# Altium schematic sheet [0X] - CPU SIGNAL.SchDoc
size 817 x 513 mm
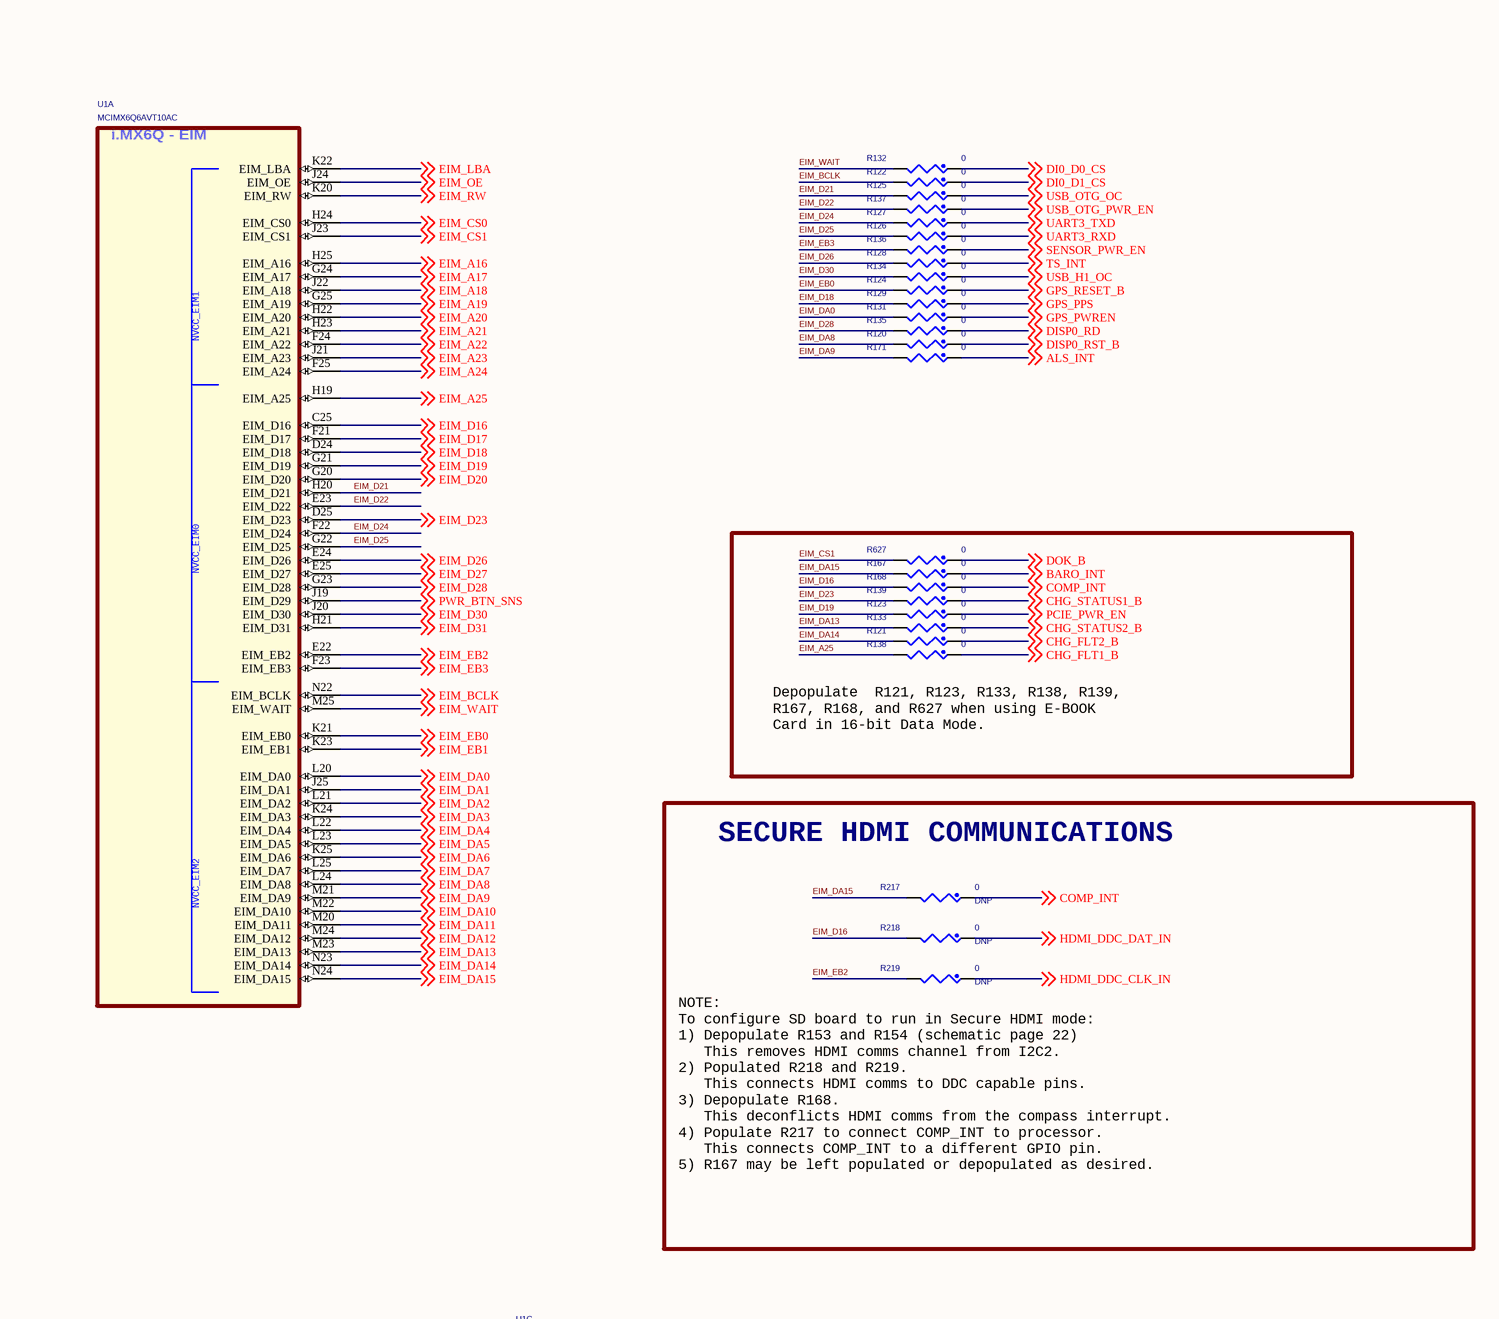
[diagram p0: [0X] - CPU SIGNAL.SchDoc, top left]
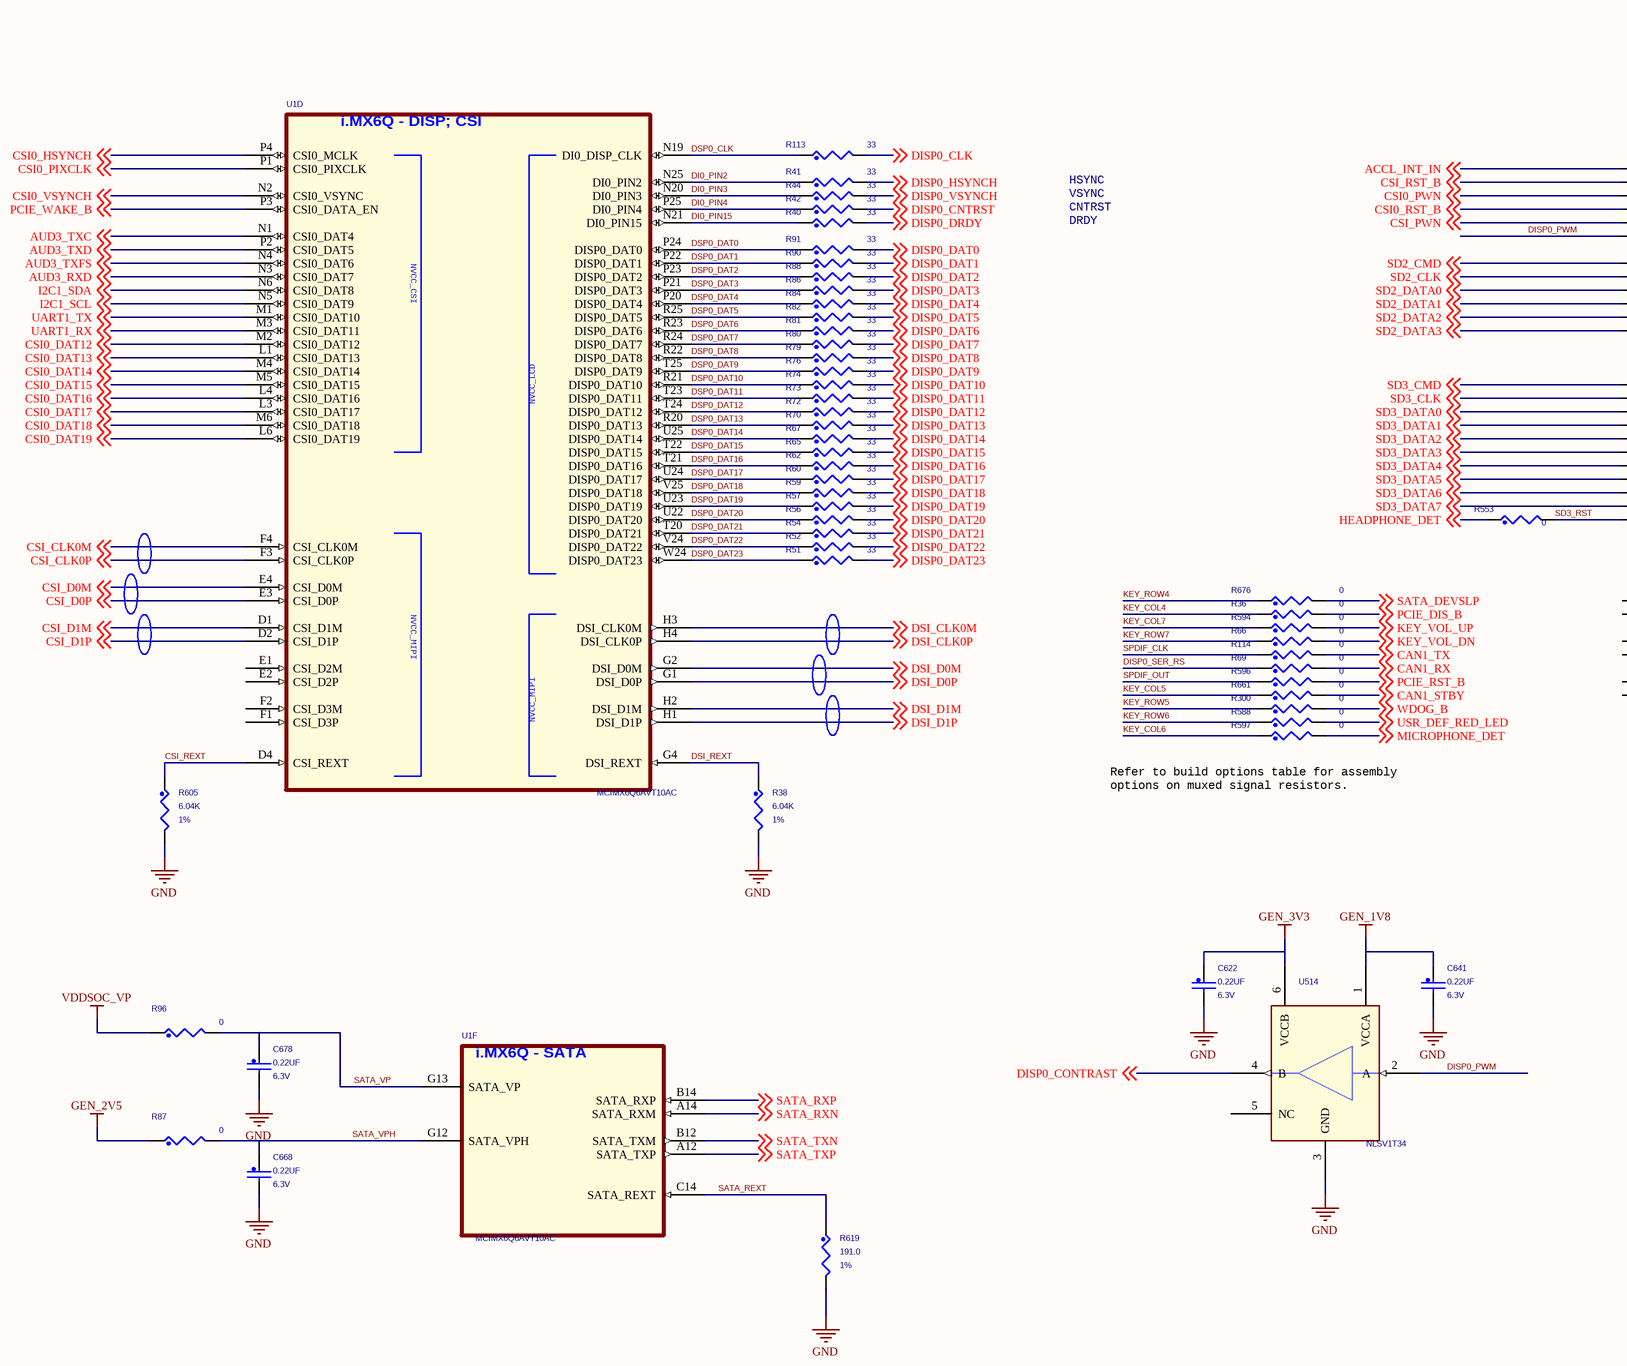
[diagram p1: [0X] - CPU SIGNAL.SchDoc, top middle]
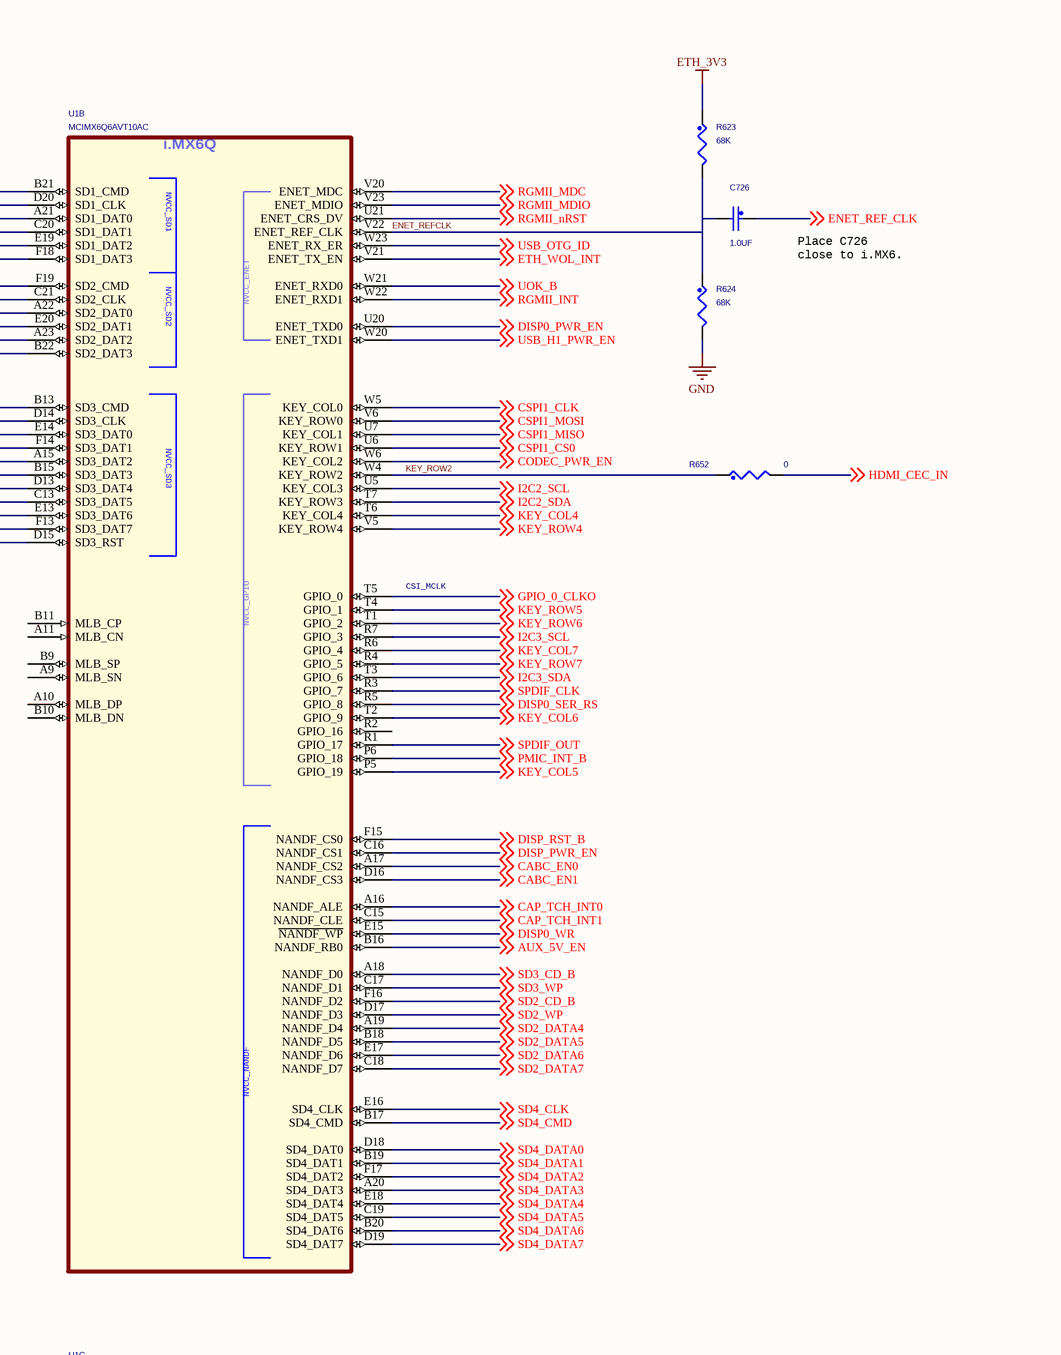
[diagram p2: [0X] - CPU SIGNAL.SchDoc, top right]
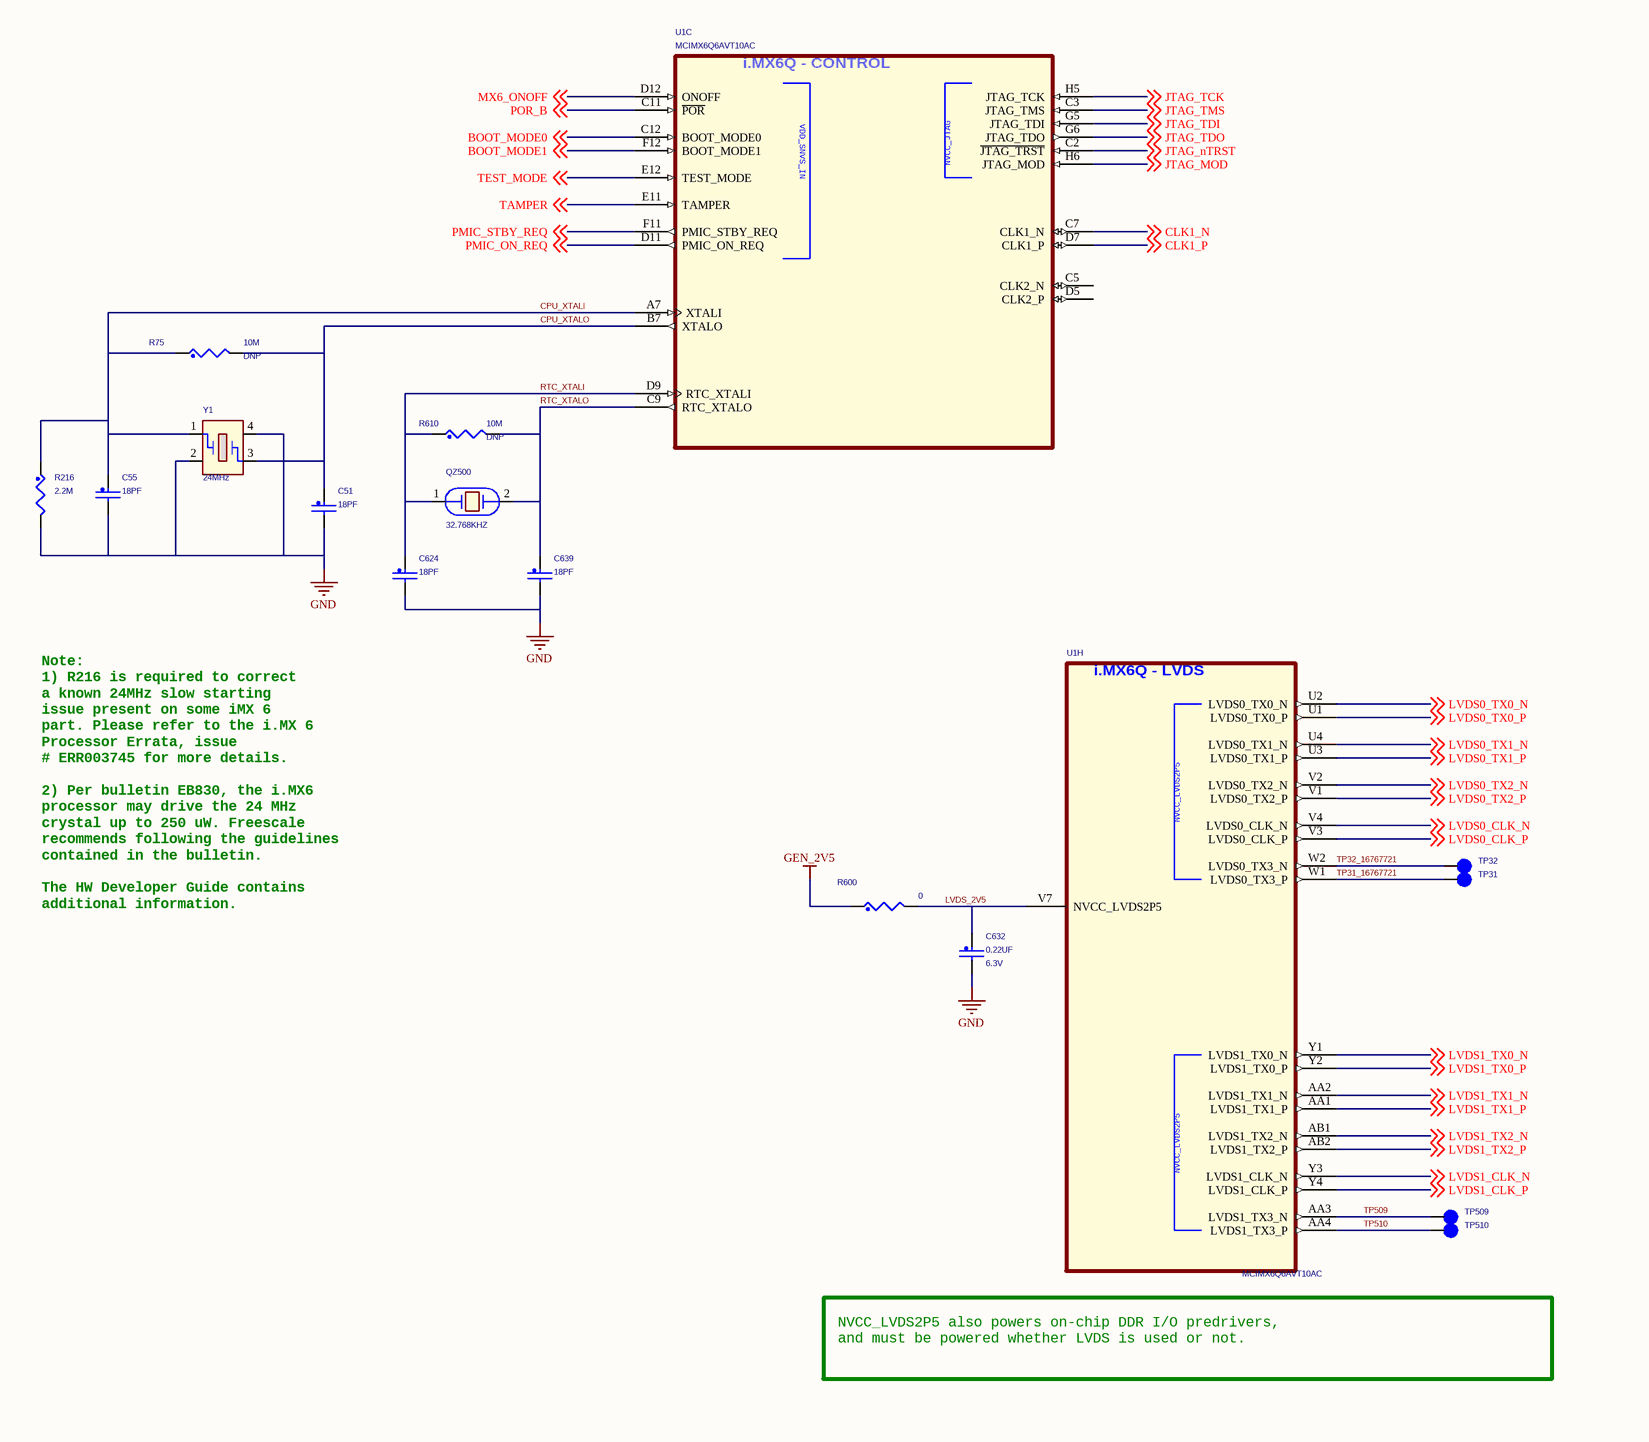
[diagram p3: [0X] - CPU SIGNAL.SchDoc, bottom left]
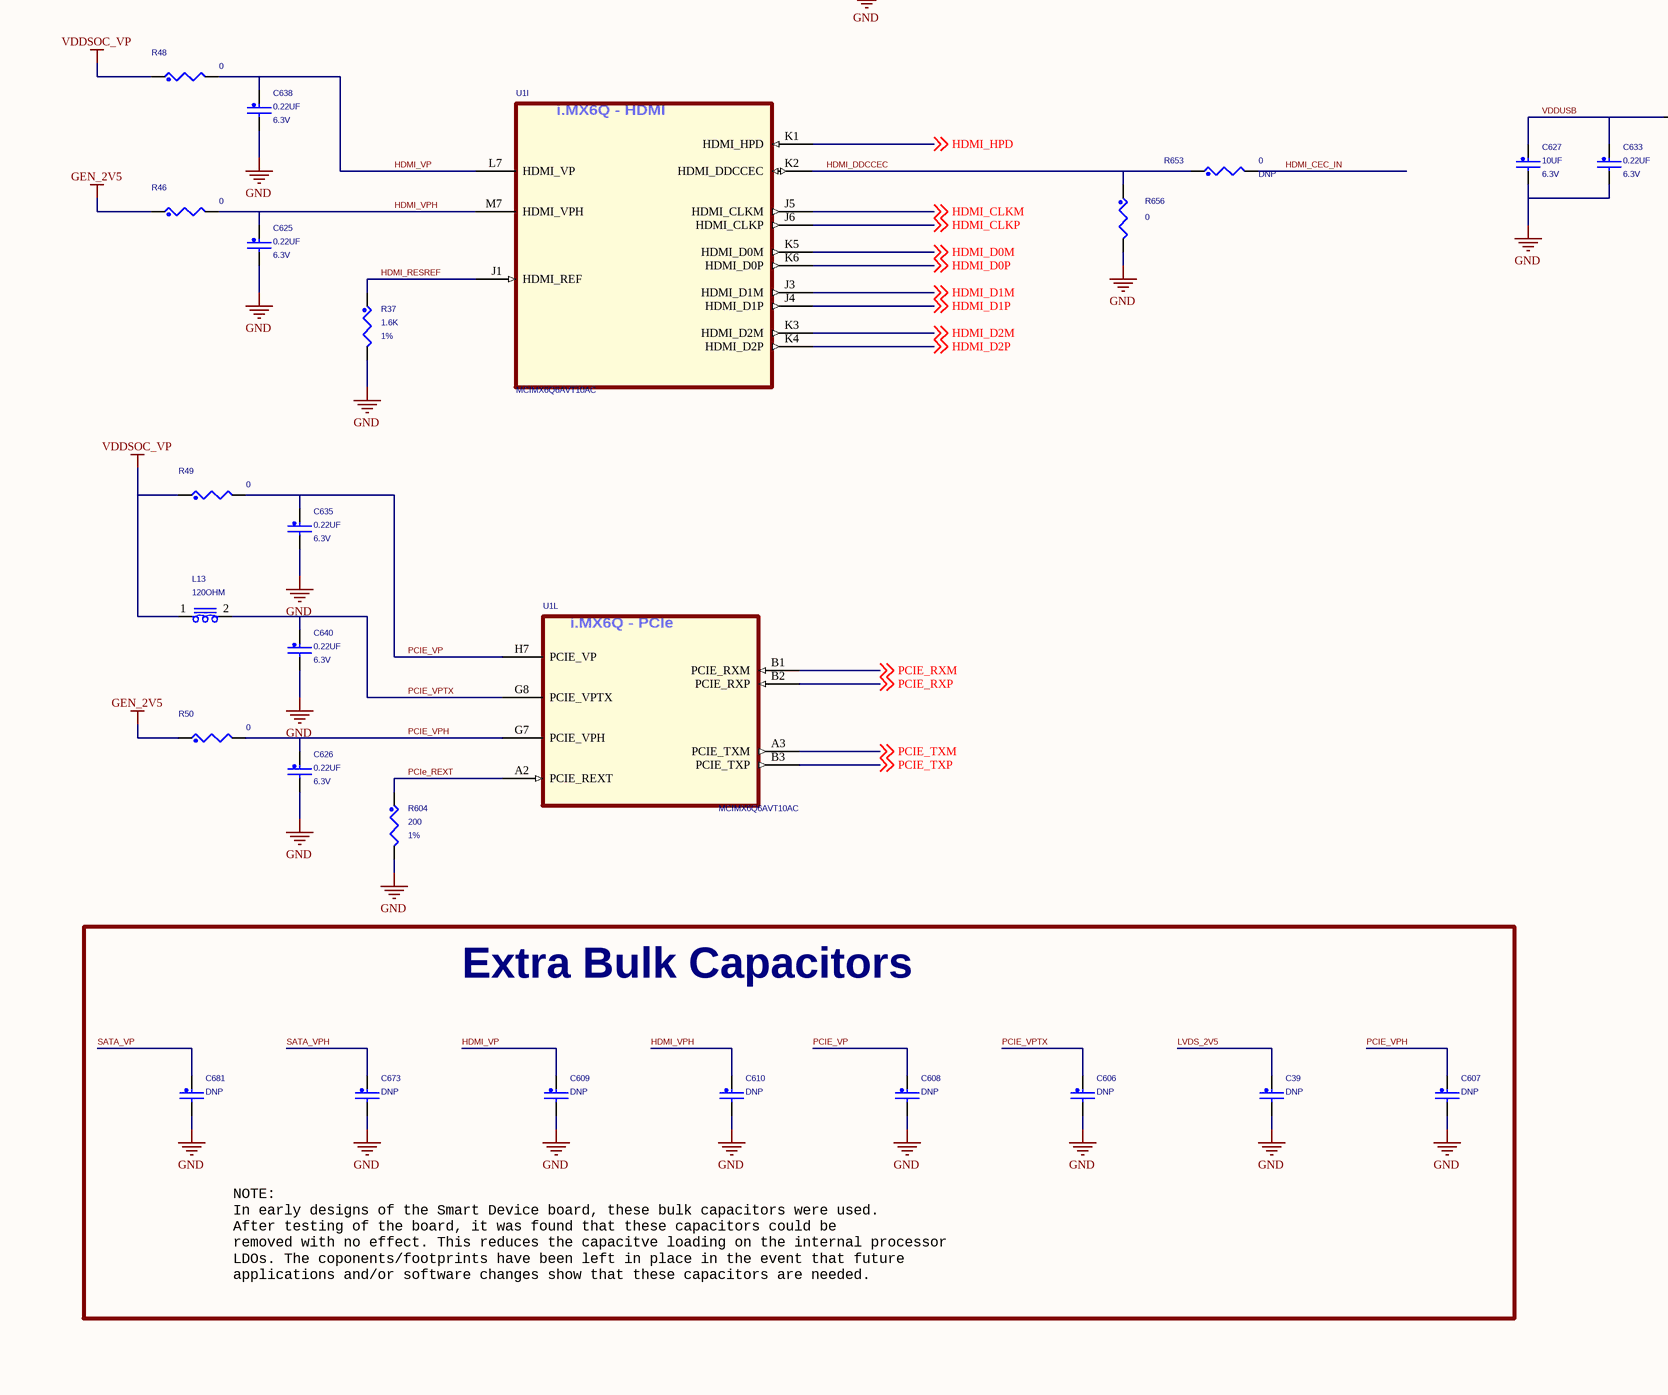
[diagram p4: [0X] - CPU SIGNAL.SchDoc, bottom middle]
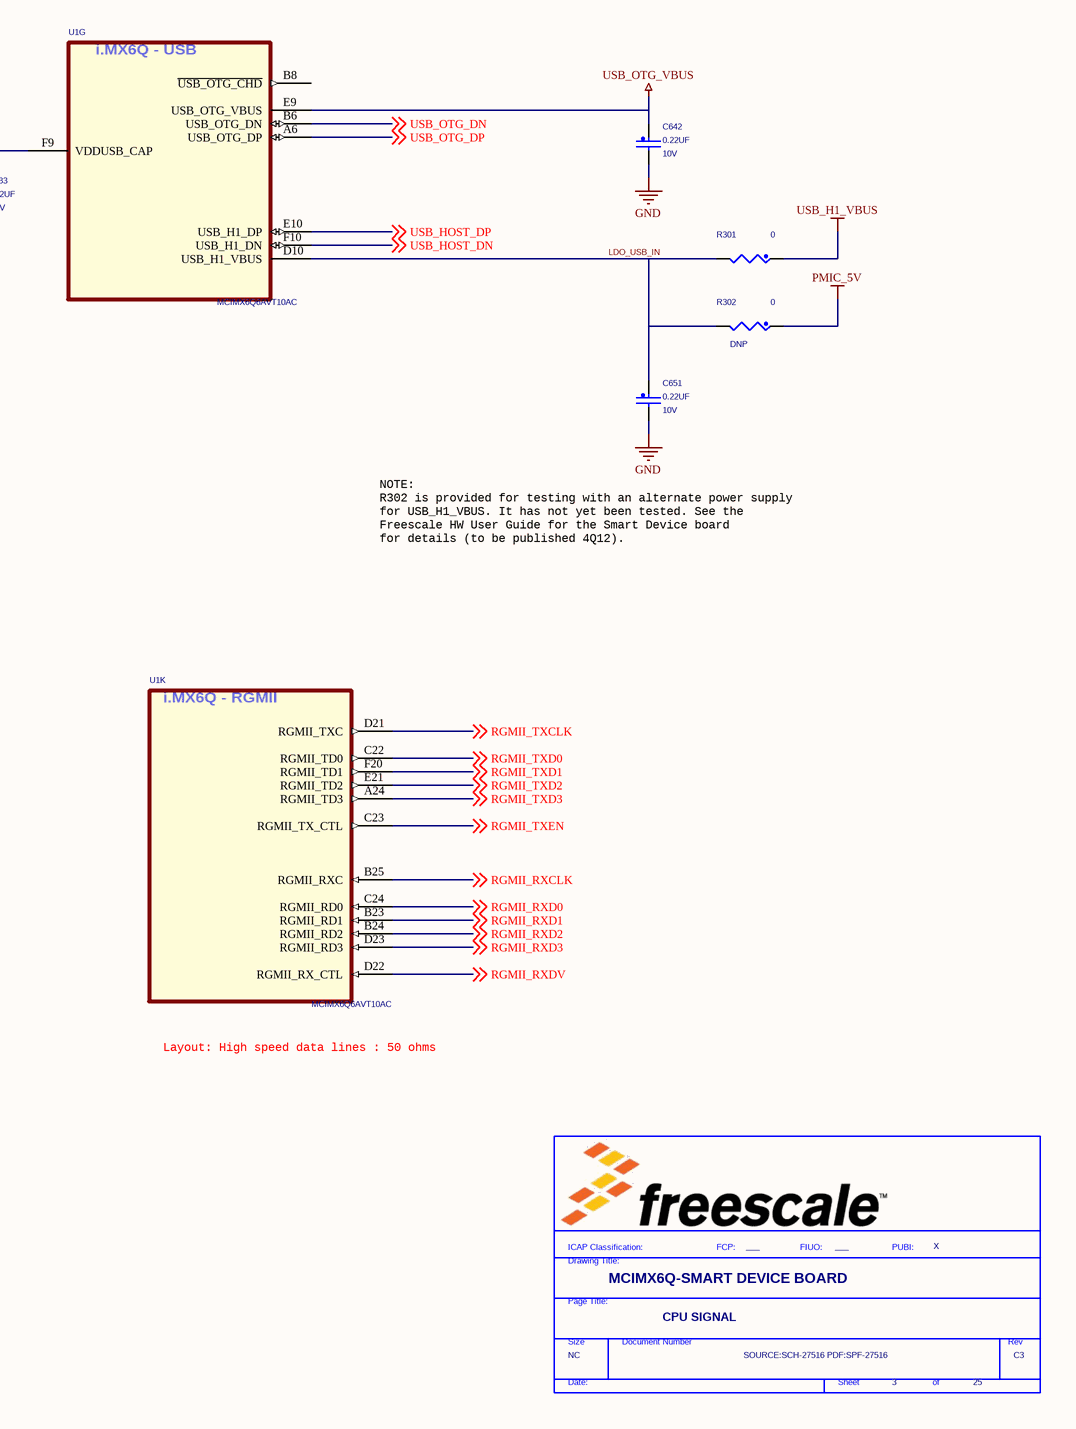
[diagram p5: [0X] - CPU SIGNAL.SchDoc, bottom right]

## Parts
*  FIUO: ___  PUBI: X  Doc: SOURCE:SCH-27516 PDF:SPF-27516  RevCode: C3  Title: MCIMX6Q-SMART DEVICE BOARD  Page Size: NC  Page Number: 3  Page Count: 25  PageTitle: CPU SIGNAL  (hidden comment: TitleBlock_FS)  (graphical)
C39  ASSY_OPT: DNP  [0603_CC]  (hidden comment: 4.7UF)
C51  18PF  [0402_CC]
C55  18PF  [0402_CC]
C606  ASSY_OPT: DNP  [0603_CC]  (hidden comment: 4.7UF)
C607  ASSY_OPT: DNP  [0603_CC]  (hidden comment: 4.7UF)
C608  ASSY_OPT: DNP  [0603_CC]  (hidden comment: 4.7UF)
C609  ASSY_OPT: DNP  [0603_CC]  (hidden comment: 4.7UF)
C610  ASSY_OPT: DNP  [0603_CC]  (hidden comment: 4.7UF)
C622  0.22UF  WVDC: 6.3V  [0201_CC]
C624  18PF  [0402_CC]
C625  0.22UF  WVDC: 6.3V  [0201_CC]
C626  0.22UF  WVDC: 6.3V  [0201_CC]
C627  10UF  WVDC: 6.3V  [0603_CC]
C632  0.22UF  WVDC: 6.3V  [0201_CC]
C633  0.22UF  WVDC: 6.3V  [0201_CC]
C635  0.22UF  WVDC: 6.3V  [0201_CC]
C638  0.22UF  WVDC: 6.3V  [0201_CC]
C639  18PF  [0402_CC]
C640  0.22UF  WVDC: 6.3V  [0201_CC]
C641  0.22UF  WVDC: 6.3V  [0201_CC]
C642  0.22UF  WVDC: 10V  [0201_CC]
C651  0.22UF  WVDC: 10V  [0201_CC]
C668  0.22UF  WVDC: 6.3V  [0201_CC]
C673  ASSY_OPT: DNP  [0603_CC]  (hidden comment: 4.7UF)
C678  0.22UF  WVDC: 6.3V  [0201_CC]
C681  ASSY_OPT: DNP  [0603_CC]  (hidden comment: 4.7UF)
C726  1.0UF  [0402_CC]
L13  120OHM  [0603_CC]
QZ500  32.768KHZ  [XTAL2-3P2X1P5-SM]
R36  0  [0402_CC]
R37  1.6K  Tolerance: 1%  [0402_CC]
R38  6.04K  Tolerance: 1%  [0402_CC]
R40  33  [0402_CC]
R41  33  [0402_CC]
R42  33  [0402_CC]
R44  33  [0402_CC]
R46  0  [0402_CC]
R48  0  [0402_CC]
R49  0  [0402_CC]
R50  0  [0402_CC]
R51  33  [0402_CC]
R52  33  [0402_CC]
R54  33  [0402_CC]
R56  33  [0402_CC]
R57  33  [0402_CC]
R59  33  [0402_CC]
R60  33  [0402_CC]
R62  33  [0402_CC]
R65  33  [0402_CC]
R66  0  [0402_CC]
R67  33  [0402_CC]
R69  0  [0402_CC]
R70  33  [0402_CC]
R72  33  [0402_CC]
R73  33  [0402_CC]
R74  33  [0402_CC]
R75  10M  ASSY_OPT: DNP  [0402_CC]
R76  33  [0402_CC]
R79  33  [0402_CC]
R80  33  [0402_CC]
R81  33  [0402_CC]
R82  33  [0402_CC]
R84  33  [0402_CC]
R86  33  [0402_CC]
R87  0  [0402_CC]
R88  33  [0402_CC]
R90  33  [0402_CC]
R91  33  [0402_CC]
R96  0  [0402_CC]
R113  33  [0402_CC]
R114  0  [0402_CC]
R120  0  [0402_CC]
R121  0  [0402_CC]
R122  0  [0402_CC]
R123  0  [0402_CC]
R124  0  [0402_CC]
R125  0  [0402_CC]
R126  0  [0402_CC]
R127  0  [0402_CC]
R128  0  [0402_CC]
R129  0  [0402_CC]
R131  0  [0402_CC]
R132  0  [0402_CC]
R133  0  [0402_CC]
R134  0  [0402_CC]
R135  0  [0402_CC]
R136  0  [0402_CC]
R137  0  [0402_CC]
R138  0  [0402_CC]
R139  0  [0402_CC]
R167  0  [0402_CC]
R168  0  [0402_CC]
R171  0  [0402_CC]
R216  2.2M  [0402_CC]
R217  0  ASSY_OPT: DNP  [0402_CC]
R218  0  ASSY_OPT: DNP  [0402_CC]
R219  0  ASSY_OPT: DNP  [0402_CC]
R300  0  [0402_CC]
R301  0  [0402_CC]
R302  0  ASSY_OPT: DNP  [0402_CC]
R553  0  [0402_CC]
R588  0  [0402_CC]
R594  0  [0402_CC]
R596  0  [0402_CC]
R597  0  [0402_CC]
R600  0  [0402_CC]
R604  200  Tolerance: 1%  [0402_CC]
R605  6.04K  Tolerance: 1%  [0402_CC]
R610  10M  ASSY_OPT: DNP  [0402_CC]
R619  191.0  Tolerance: 1%  [0603_CC]
R623  68K  [0402_CC]
R624  68K  [0402_CC]
R627  0  [0402_CC]
R652  0  [0402_CC]
R653  0  ASSY_OPT: DNP  [0402_CC]
R656  0  [0402_CC]
R661  0  [0402_CC]
R676  0  [0402_CC]
TP31  tpad_020  [tpad_020]  (value not drawn)
TP32  tpad_020  [tpad_020]  (value not drawn)
TP509  tpad_020  [tpad_020]  (value not drawn)
TP510  tpad_020  [tpad_020]  (value not drawn)
U1  MCIMX6Q6AVT10AC  [BGA624_0P8_21X21]  (parts A,B,C,D,F,G,H,I,K,L of 12)
U514  NLSV1T34  [ullga6_1p45x1_0p5mm]
Y1  24MHz  [xtal4_sx_3225]

## Blocks framed on the sheet
SECURE HDMI COMMUNICATIONS: R217-R219
Extra Bulk Capacitors: C39 C606-C610 C673 C681

## Nets
ETH_3V3: R623.1
GEN_1V8: C641.1 U514.1(VCCA)
GEN_2V5: R46.1 R50.1 R87.1 R600.1
GEN_3V3: C622.1 U514.6(VCCB)
GND: C39.2 C51.2 C55.2 C606.2 C607.2 C608.2 C609.2 C610.2 C622.2 C624.2 C625.2 C626.2 C627.2 C632.2 C633.2 C635.2 C638.2 C639.2 C640.2 C641.2 C642.2 C651.2 C668.2 C673.2 C678.2 C681.2 R37.2 R38.2 R216.2 R604.2 R605.2 R619.2 R624.2 R656.2 U514.3(GND) Y1.2 Y1.4
PMIC_5V: R302.1
USB_H1_VBUS: R301.1
USB_OTG_VBUS: C642.1 U1.E9(USB_OTG_VBUS)
VDDSOC_VP: L13.1 R48.1 R49.1 R96.1
ACCL_INT_IN: U1.B21(SD1_CMD) ; off-sheet ACCL_INT_IN
ALS_INT: R171.1 ; off-sheet ALS_INT
AUD3_RXD: U1.N3(CSI0_DAT7) ; off-sheet AUD3_RXD
AUD3_TXC: U1.N1(CSI0_DAT4) ; off-sheet AUD3_TXC
AUD3_TXD: U1.P2(CSI0_DAT5) ; off-sheet AUD3_TXD
AUD3_TXFS: U1.N4(CSI0_DAT6) ; off-sheet AUD3_TXFS
AUX_5V_EN: U1.B16(NANDF_RB0) ; off-sheet AUX_5V_EN
BARO_INT: R167.1 ; off-sheet BARO_INT
BOOT_MODE0: U1.C12(BOOT_MODE0) ; off-sheet BOOT_MODE0
BOOT_MODE1: U1.F12(BOOT_MODE1) ; off-sheet BOOT_MODE1
CABC_EN0: U1.A17(NANDF_CS2) ; off-sheet CABC_EN0
CABC_EN1: U1.D16(NANDF_CS3) ; off-sheet CABC_EN1
CAN1_RX: R69.2 ; off-sheet CAN1_RX
CAN1_STBY: R661.2 ; off-sheet CAN1_STBY
CAN1_TX: R114.2 ; off-sheet CAN1_TX
CAP_TCH_INT0: U1.A16(NANDF_ALE) ; off-sheet CAP_TCH_INT0
CAP_TCH_INT1: U1.C15(NANDF_CLE) ; off-sheet CAP_TCH_INT1
CHG_FLT1_B: R138.1 ; off-sheet CHG_FLT1_B
CHG_FLT2_B: R121.1 ; off-sheet CHG_FLT2_B
CHG_STATUS1_B: R139.1 ; off-sheet CHG_STATUS1_B
CHG_STATUS2_B: R133.1 ; off-sheet CHG_STATUS2_B
CLK1_N: U1.C7(CLK1_N) ; off-sheet CLK1_N
CLK1_P: U1.D7(CLK1_P) ; off-sheet CLK1_P
CODEC_PWR_EN: U1.W6(KEY_COL2) ; off-sheet CODEC_PWR_EN
COMP_INT: R168.1 R217.1 ; off-sheet COMP_INT
CPU_XTALI: C55.1 R75.1 R216.1 U1.A7(XTALI) Y1.1
CPU_XTALO: C51.1 R75.2 U1.B7(XTALO) Y1.3
CSI0_DAT12: U1.M2(CSI0_DAT12) ; off-sheet CSI0_DAT12
CSI0_DAT13: U1.L1(CSI0_DAT13) ; off-sheet CSI0_DAT13
CSI0_DAT14: U1.M4(CSI0_DAT14) ; off-sheet CSI0_DAT14
CSI0_DAT15: U1.M5(CSI0_DAT15) ; off-sheet CSI0_DAT15
CSI0_DAT16: U1.L4(CSI0_DAT16) ; off-sheet CSI0_DAT16
CSI0_DAT17: U1.L3(CSI0_DAT17) ; off-sheet CSI0_DAT17
CSI0_DAT18: U1.M6(CSI0_DAT18) ; off-sheet CSI0_DAT18
CSI0_DAT19: U1.L6(CSI0_DAT19) ; off-sheet CSI0_DAT19
CSI0_HSYNCH: U1.P4(CSI0_MCLK) ; off-sheet CSI0_HSYNCH
CSI0_PIXCLK: U1.P1(CSI0_PIXCLK) ; off-sheet CSI0_PIXCLK
CSI0_PWN: U1.A21(SD1_DAT0) ; off-sheet CSI0_PWN
CSI0_RST_B: U1.C20(SD1_DAT1) ; off-sheet CSI0_RST_B
CSI0_VSYNCH: U1.N2(CSI0_VSYNC) ; off-sheet CSI0_VSYNCH
CSI_CLK0M: U1.F4(CSI_CLK0M) ; off-sheet CSI_CLK0M
CSI_CLK0P: U1.F3(CSI_CLK0P) ; off-sheet CSI_CLK0P
CSI_D0M: U1.E4(CSI_D0M) ; off-sheet CSI_D0M
CSI_D0P: U1.E3(CSI_D0P) ; off-sheet CSI_D0P
CSI_D1M: U1.D1(CSI_D1M) ; off-sheet CSI_D1M
CSI_D1P: U1.D2(CSI_D1P) ; off-sheet CSI_D1P
CSI_PWN: U1.E19(SD1_DAT2) ; off-sheet CSI_PWN
CSI_REXT: R605.1 U1.D4(CSI_REXT)
CSI_RST_B: U1.D20(SD1_CLK) ; off-sheet CSI_RST_B
CSPI1_CLK: U1.W5(KEY_COL0) ; off-sheet CSPI1_CLK
CSPI1_CS0: U1.U6(KEY_ROW1) ; off-sheet CSPI1_CS0
CSPI1_MISO: U1.U7(KEY_COL1) ; off-sheet CSPI1_MISO
CSPI1_MOSI: U1.V6(KEY_ROW0) ; off-sheet CSPI1_MOSI
DI0_D0_CS: R132.1 ; off-sheet DI0_D0_CS
DI0_D1_CS: R122.1 ; off-sheet DI0_D1_CS
DI0_PIN2: R41.1 U1.N25(DI0_PIN2)
DI0_PIN3: R44.1 U1.N20(DI0_PIN3)
DI0_PIN4: R42.1 U1.P25(DI0_PIN4)
DI0_PIN15: R40.1 U1.N21(DI0_PIN15)
DISP0_CLK: R113.2 ; off-sheet DISP0_CLK
DISP0_CNTRST: R42.2 ; off-sheet DISP0_CNTRST
DISP0_CONTRAST: U514.4(B) ; off-sheet DISP0_CONTRAST
DISP0_DAT0: R91.2 ; off-sheet DISP0_DAT0
DISP0_DAT1: R90.2 ; off-sheet DISP0_DAT1
DISP0_DAT2: R88.2 ; off-sheet DISP0_DAT2
DISP0_DAT3: R86.2 ; off-sheet DISP0_DAT3
DISP0_DAT4: R84.2 ; off-sheet DISP0_DAT4
DISP0_DAT5: R82.2 ; off-sheet DISP0_DAT5
DISP0_DAT6: R81.2 ; off-sheet DISP0_DAT6
DISP0_DAT7: R80.2 ; off-sheet DISP0_DAT7
DISP0_DAT8: R79.2 ; off-sheet DISP0_DAT8
DISP0_DAT9: R76.2 ; off-sheet DISP0_DAT9
DISP0_DAT10: R74.2 ; off-sheet DISP0_DAT10
DISP0_DAT11: R73.2 ; off-sheet DISP0_DAT11
DISP0_DAT12: R72.2 ; off-sheet DISP0_DAT12
DISP0_DAT13: R70.2 ; off-sheet DISP0_DAT13
DISP0_DAT14: R67.2 ; off-sheet DISP0_DAT14
DISP0_DAT15: R65.2 ; off-sheet DISP0_DAT15
DISP0_DAT16: R62.2 ; off-sheet DISP0_DAT16
DISP0_DAT17: R60.2 ; off-sheet DISP0_DAT17
DISP0_DAT18: R59.2 ; off-sheet DISP0_DAT18
DISP0_DAT19: R57.2 ; off-sheet DISP0_DAT19
DISP0_DAT20: R56.2 ; off-sheet DISP0_DAT20
DISP0_DAT21: R54.2 ; off-sheet DISP0_DAT21
DISP0_DAT22: R52.2 ; off-sheet DISP0_DAT22
DISP0_DAT23: R51.2 ; off-sheet DISP0_DAT23
DISP0_DRDY: R40.2 ; off-sheet DISP0_DRDY
DISP0_HSYNCH: R41.2 ; off-sheet DISP0_HSYNCH
DISP0_PWM: U1.F18(SD1_DAT3) U514.2(A)
DISP0_PWR_EN: U1.U20(ENET_TXD0) ; off-sheet DISP0_PWR_EN
DISP0_RD: R135.1 ; off-sheet DISP0_RD
DISP0_RST_B: R120.1 ; off-sheet DISP0_RST_B
DISP0_SER_RS: R69.1 U1.R5(GPIO_8) ; off-sheet DISP0_SER_RS
DISP0_VSYNCH: R44.2 ; off-sheet DISP0_VSYNCH
DISP0_WR: U1.E15(~{NANDF_WP}) ; off-sheet DISP0_WR
DISP_PWR_EN: U1.C16(NANDF_CS1) ; off-sheet DISP_PWR_EN
DISP_RST_B: U1.F15(NANDF_CS0) ; off-sheet DISP_RST_B
DOK_B: R627.1 ; off-sheet DOK_B
DSI_CLK0M: U1.H3(DSI_CLK0M) ; off-sheet DSI_CLK0M
DSI_CLK0P: U1.H4(DSI_CLK0P) ; off-sheet DSI_CLK0P
DSI_D0M: U1.G2(DSI_D0M) ; off-sheet DSI_D0M
DSI_D0P: U1.G1(DSI_D0P) ; off-sheet DSI_D0P
DSI_D1M: U1.H2(DSI_D1M) ; off-sheet DSI_D1M
DSI_D1P: U1.H1(DSI_D1P) ; off-sheet DSI_D1P
DSI_REXT: R38.1 U1.G4(DSI_REXT)
DSP0_CLK: R113.1 U1.N19(DI0_DISP_CLK)
DSP0_DAT0: R91.1 U1.P24(DISP0_DAT0)
DSP0_DAT1: R90.1 U1.P22(DISP0_DAT1)
DSP0_DAT2: R88.1 U1.P23(DISP0_DAT2)
DSP0_DAT3: R86.1 U1.P21(DISP0_DAT3)
DSP0_DAT4: R84.1 U1.P20(DISP0_DAT4)
DSP0_DAT5: R82.1 U1.R25(DISP0_DAT5)
DSP0_DAT6: R81.1 U1.R23(DISP0_DAT6)
DSP0_DAT7: R80.1 U1.R24(DISP0_DAT7)
DSP0_DAT8: R79.1 U1.R22(DISP0_DAT8)
DSP0_DAT9: R76.1 U1.T25(DISP0_DAT9)
DSP0_DAT10: R74.1 U1.R21(DISP0_DAT10)
DSP0_DAT11: R73.1 U1.T23(DISP0_DAT11)
DSP0_DAT12: R72.1 U1.T24(DISP0_DAT12)
DSP0_DAT13: R70.1 U1.R20(DISP0_DAT13)
DSP0_DAT14: R67.1 U1.U25(DISP0_DAT14)
DSP0_DAT15: R65.1 U1.T22(DISP0_DAT15)
DSP0_DAT16: R62.1 U1.T21(DISP0_DAT16)
DSP0_DAT17: R60.1 U1.U24(DISP0_DAT17)
DSP0_DAT18: R59.1 U1.V25(DISP0_DAT18)
DSP0_DAT19: R57.1 U1.U23(DISP0_DAT19)
DSP0_DAT20: R56.1 U1.U22(DISP0_DAT20)
DSP0_DAT21: R54.1 U1.T20(DISP0_DAT21)
DSP0_DAT22: R52.1 U1.V24(DISP0_DAT22)
DSP0_DAT23: R51.1 U1.W24(DISP0_DAT23)
EIM_A16: U1.H25(EIM_A16) ; off-sheet EIM_A16
EIM_A17: U1.G24(EIM_A17) ; off-sheet EIM_A17
EIM_A18: U1.J22(EIM_A18) ; off-sheet EIM_A18
EIM_A19: U1.G25(EIM_A19) ; off-sheet EIM_A19
EIM_A20: U1.H22(EIM_A20) ; off-sheet EIM_A20
EIM_A21: U1.H23(EIM_A21) ; off-sheet EIM_A21
EIM_A22: U1.F24(EIM_A22) ; off-sheet EIM_A22
EIM_A23: U1.J21(EIM_A23) ; off-sheet EIM_A23
EIM_A24: U1.F25(EIM_A24) ; off-sheet EIM_A24
EIM_A25: R138.2 U1.H19(EIM_A25) ; off-sheet EIM_A25
EIM_BCLK: R122.2 U1.N22(EIM_BCLK) ; off-sheet EIM_BCLK
EIM_CS0: U1.H24(EIM_CS0) ; off-sheet EIM_CS0
EIM_CS1: R627.2 U1.J23(EIM_CS1) ; off-sheet EIM_CS1
EIM_D16: R168.2 R218.2 U1.C25(EIM_D16) ; off-sheet EIM_D16
EIM_D17: U1.F21(EIM_D17) ; off-sheet EIM_D17
EIM_D18: R129.2 U1.D24(EIM_D18) ; off-sheet EIM_D18
EIM_D19: R123.2 U1.G21(EIM_D19) ; off-sheet EIM_D19
EIM_D20: U1.G20(EIM_D20) ; off-sheet EIM_D20
EIM_D21: R125.2 U1.H20(EIM_D21)
EIM_D22: R137.2 U1.E23(EIM_D22)
EIM_D23: R139.2 U1.D25(EIM_D23) ; off-sheet EIM_D23
EIM_D24: R127.2 U1.F22(EIM_D24)
EIM_D25: R126.2 U1.G22(EIM_D25)
EIM_D26: R128.2 U1.E24(EIM_D26) ; off-sheet EIM_D26
EIM_D27: U1.E25(EIM_D27) ; off-sheet EIM_D27
EIM_D28: R135.2 U1.G23(EIM_D28) ; off-sheet EIM_D28
EIM_D30: R134.2 U1.J20(EIM_D30) ; off-sheet EIM_D30
EIM_D31: U1.H21(EIM_D31) ; off-sheet EIM_D31
EIM_DA0: R131.2 U1.L20(EIM_DA0) ; off-sheet EIM_DA0
EIM_DA1: U1.J25(EIM_DA1) ; off-sheet EIM_DA1
EIM_DA2: U1.L21(EIM_DA2) ; off-sheet EIM_DA2
EIM_DA3: U1.K24(EIM_DA3) ; off-sheet EIM_DA3
EIM_DA4: U1.L22(EIM_DA4) ; off-sheet EIM_DA4
EIM_DA5: U1.L23(EIM_DA5) ; off-sheet EIM_DA5
EIM_DA6: U1.K25(EIM_DA6) ; off-sheet EIM_DA6
EIM_DA7: U1.L25(EIM_DA7) ; off-sheet EIM_DA7
EIM_DA8: R120.2 U1.L24(EIM_DA8) ; off-sheet EIM_DA8
EIM_DA9: R171.2 U1.M21(EIM_DA9) ; off-sheet EIM_DA9
EIM_DA10: U1.M22(EIM_DA10) ; off-sheet EIM_DA10
EIM_DA11: U1.M20(EIM_DA11) ; off-sheet EIM_DA11
EIM_DA12: U1.M24(EIM_DA12) ; off-sheet EIM_DA12
EIM_DA13: R133.2 U1.M23(EIM_DA13) ; off-sheet EIM_DA13
EIM_DA14: R121.2 U1.N23(EIM_DA14) ; off-sheet EIM_DA14
EIM_DA15: R167.2 R217.2 U1.N24(EIM_DA15) ; off-sheet EIM_DA15
EIM_EB0: R124.2 U1.K21(EIM_EB0) ; off-sheet EIM_EB0
EIM_EB1: U1.K23(EIM_EB1) ; off-sheet EIM_EB1
EIM_EB2: R219.2 U1.E22(EIM_EB2) ; off-sheet EIM_EB2
EIM_EB3: R136.2 U1.F23(EIM_EB3) ; off-sheet EIM_EB3
EIM_LBA: U1.K22(EIM_LBA) ; off-sheet EIM_LBA
EIM_OE: U1.J24(EIM_OE) ; off-sheet EIM_OE
EIM_RW: U1.K20(EIM_RW) ; off-sheet EIM_RW
EIM_WAIT: R132.2 U1.M25(EIM_WAIT) ; off-sheet EIM_WAIT
ENET_REF_CLK: C726.1 ; off-sheet ENET_REF_CLK
ENET_REFCLK: C726.2 R623.2 R624.1 U1.V22(ENET_REF_CLK)
ETH_WOL_INT: U1.V21(ENET_TX_EN) ; off-sheet ETH_WOL_INT
GPIO_0_CLKO: U1.T5(GPIO_0) ; off-sheet GPIO_0_CLKO
GPS_PPS: R129.1 ; off-sheet GPS_PPS
GPS_PWREN: R131.1 ; off-sheet GPS_PWREN
GPS_RESET_B: R124.1 ; off-sheet GPS_RESET_B
HDMI_CEC_IN: R652.2 R653.2 ; off-sheet HDMI_CEC_IN
HDMI_CLKM: U1.J5(HDMI_CLKM) ; off-sheet HDMI_CLKM
HDMI_CLKP: U1.J6(HDMI_CLKP) ; off-sheet HDMI_CLKP
HDMI_D0M: U1.K5(HDMI_D0M) ; off-sheet HDMI_D0M
HDMI_D0P: U1.K6(HDMI_D0P) ; off-sheet HDMI_D0P
HDMI_D1M: U1.J3(HDMI_D1M) ; off-sheet HDMI_D1M
HDMI_D1P: U1.J4(HDMI_D1P) ; off-sheet HDMI_D1P
HDMI_D2M: U1.K3(HDMI_D2M) ; off-sheet HDMI_D2M
HDMI_D2P: U1.K4(HDMI_D2P) ; off-sheet HDMI_D2P
HDMI_DDC_CLK_IN: R219.1 ; off-sheet HDMI_DDC_CLK_IN
HDMI_DDC_DAT_IN: R218.1 ; off-sheet HDMI_DDC_DAT_IN
HDMI_DDCCEC: R653.1 R656.1 U1.K2(HDMI_DDCCEC)
HDMI_HPD: U1.K1(HDMI_HPD) ; off-sheet HDMI_HPD
HDMI_RESREF: R37.1 U1.J1(HDMI_REF)
HDMI_VP: C609.1 C638.1 R48.2 U1.L7(HDMI_VP)
HDMI_VPH: C610.1 C625.1 R46.2 U1.M7(HDMI_VPH)
HEADPHONE_DET: R553.1 ; off-sheet HEADPHONE_DET
I2C1_SCL: U1.N5(CSI0_DAT9) ; off-sheet I2C1_SCL
I2C1_SDA: U1.N6(CSI0_DAT8) ; off-sheet I2C1_SDA
I2C2_SCL: U1.U5(KEY_COL3) ; off-sheet I2C2_SCL
I2C2_SDA: U1.T7(KEY_ROW3) ; off-sheet I2C2_SDA
I2C3_SCL: U1.R7(GPIO_3) ; off-sheet I2C3_SCL
I2C3_SDA: U1.T3(GPIO_6) ; off-sheet I2C3_SDA
JTAG_MOD: U1.H6(JTAG_MOD) ; off-sheet JTAG_MOD
JTAG_nTRST: U1.C2(~{JTAG_TRST}) ; off-sheet JTAG_nTRST
JTAG_TCK: U1.H5(JTAG_TCK) ; off-sheet JTAG_TCK
JTAG_TDI: U1.G5(JTAG_TDI) ; off-sheet JTAG_TDI
JTAG_TDO: U1.G6(JTAG_TDO) ; off-sheet JTAG_TDO
JTAG_TMS: U1.C3(JTAG_TMS) ; off-sheet JTAG_TMS
KEY_COL4: R36.1 U1.T6(KEY_COL4) ; off-sheet KEY_COL4
KEY_COL5: R661.1 U1.P5(GPIO_19) ; off-sheet KEY_COL5
KEY_COL6: R597.1 U1.T2(GPIO_9) ; off-sheet KEY_COL6
KEY_COL7: R594.1 U1.R6(GPIO_4) ; off-sheet KEY_COL7
KEY_ROW2: R652.1 U1.W4(KEY_ROW2)
KEY_ROW4: R676.1 U1.V5(KEY_ROW4) ; off-sheet KEY_ROW4
KEY_ROW5: R300.1 U1.T4(GPIO_1) ; off-sheet KEY_ROW5
KEY_ROW6: R588.1 U1.T1(GPIO_2) ; off-sheet KEY_ROW6
KEY_ROW7: R66.1 U1.R4(GPIO_5) ; off-sheet KEY_ROW7
KEY_VOL_DN: R66.2 ; off-sheet KEY_VOL_DN
KEY_VOL_UP: R594.2 ; off-sheet KEY_VOL_UP
LDO_USB_IN: C651.1 R301.2 R302.2 U1.D10(USB_H1_VBUS)
LVDS0_CLK_N: U1.V4(LVDS0_CLK_N) ; off-sheet LVDS0_CLK_N
LVDS0_CLK_P: U1.V3(LVDS0_CLK_P) ; off-sheet LVDS0_CLK_P
LVDS0_TX0_N: U1.U2(LVDS0_TX0_N) ; off-sheet LVDS0_TX0_N
LVDS0_TX0_P: U1.U1(LVDS0_TX0_P) ; off-sheet LVDS0_TX0_P
LVDS0_TX1_N: U1.U4(LVDS0_TX1_N) ; off-sheet LVDS0_TX1_N
LVDS0_TX1_P: U1.U3(LVDS0_TX1_P) ; off-sheet LVDS0_TX1_P
LVDS0_TX2_N: U1.V2(LVDS0_TX2_N) ; off-sheet LVDS0_TX2_N
LVDS0_TX2_P: U1.V1(LVDS0_TX2_P) ; off-sheet LVDS0_TX2_P
LVDS1_CLK_N: U1.Y3(LVDS1_CLK_N) ; off-sheet LVDS1_CLK_N
LVDS1_CLK_P: U1.Y4(LVDS1_CLK_P) ; off-sheet LVDS1_CLK_P
LVDS1_TX0_N: U1.Y1(LVDS1_TX0_N) ; off-sheet LVDS1_TX0_N
LVDS1_TX0_P: U1.Y2(LVDS1_TX0_P) ; off-sheet LVDS1_TX0_P
LVDS1_TX1_N: U1.AA2(LVDS1_TX1_N) ; off-sheet LVDS1_TX1_N
LVDS1_TX1_P: U1.AA1(LVDS1_TX1_P) ; off-sheet LVDS1_TX1_P
LVDS1_TX2_N: U1.AB1(LVDS1_TX2_N) ; off-sheet LVDS1_TX2_N
LVDS1_TX2_P: U1.AB2(LVDS1_TX2_P) ; off-sheet LVDS1_TX2_P
LVDS_2V5: C39.1 C632.1 R600.2 U1.V7(NVCC_LVDS2P5)
MICROPHONE_DET: R597.2 ; off-sheet MICROPHONE_DET
MX6_ONOFF: U1.D12(ONOFF) ; off-sheet MX6_ONOFF
PCIE_DIS_B: R36.2 ; off-sheet PCIE_DIS_B
PCIE_PWR_EN: R123.1 ; off-sheet PCIE_PWR_EN
PCIe_REXT: R604.1 U1.A2(PCIE_REXT)
PCIE_RST_B: R596.2 ; off-sheet PCIE_RST_B
PCIE_RXM: U1.B1(PCIE_RXM) ; off-sheet PCIE_RXM
PCIE_RXP: U1.B2(PCIE_RXP) ; off-sheet PCIE_RXP
PCIE_TXM: U1.A3(PCIE_TXM) ; off-sheet PCIE_TXM
PCIE_TXP: U1.B3(PCIE_TXP) ; off-sheet PCIE_TXP
PCIE_VP: C608.1 C635.1 R49.2 U1.H7(PCIE_VP)
PCIE_VPH: C607.1 C626.1 R50.2 U1.G7(PCIE_VPH)
PCIE_VPTX: C606.1 C640.1 L13.2 U1.G8(PCIE_VPTX)
PCIE_WAKE_B: U1.P3(CSI0_DATA_EN) ; off-sheet PCIE_WAKE_B
PMIC_INT_B: U1.P6(GPIO_18) ; off-sheet PMIC_INT_B
PMIC_ON_REQ: U1.D11(PMIC_ON_REQ) ; off-sheet PMIC_ON_REQ
PMIC_STBY_REQ: U1.F11(PMIC_STBY_REQ) ; off-sheet PMIC_STBY_REQ
POR_B: U1.C11(~{POR}) ; off-sheet POR_B
PWR_BTN_SNS: U1.J19(EIM_D29) ; off-sheet PWR_BTN_SNS
RGMII_INT: U1.W22(ENET_RXD1) ; off-sheet RGMII_INT
RGMII_MDC: U1.V20(ENET_MDC) ; off-sheet RGMII_MDC
RGMII_MDIO: U1.V23(ENET_MDIO) ; off-sheet RGMII_MDIO
RGMII_nRST: U1.U21(ENET_CRS_DV) ; off-sheet RGMII_nRST
RGMII_RXCLK: U1.B25(RGMII_RXC) ; off-sheet RGMII_RXCLK
RGMII_RXD0: U1.C24(RGMII_RD0) ; off-sheet RGMII_RXD0
RGMII_RXD1: U1.B23(RGMII_RD1) ; off-sheet RGMII_RXD1
RGMII_RXD2: U1.B24(RGMII_RD2) ; off-sheet RGMII_RXD2
RGMII_RXD3: U1.D23(RGMII_RD3) ; off-sheet RGMII_RXD3
RGMII_RXDV: U1.D22(RGMII_RX_CTL) ; off-sheet RGMII_RXDV
RGMII_TXCLK: U1.D21(RGMII_TXC) ; off-sheet RGMII_TXCLK
RGMII_TXD0: U1.C22(RGMII_TD0) ; off-sheet RGMII_TXD0
RGMII_TXD1: U1.F20(RGMII_TD1) ; off-sheet RGMII_TXD1
RGMII_TXD2: U1.E21(RGMII_TD2) ; off-sheet RGMII_TXD2
RGMII_TXD3: U1.A24(RGMII_TD3) ; off-sheet RGMII_TXD3
RGMII_TXEN: U1.C23(RGMII_TX_CTL) ; off-sheet RGMII_TXEN
RTC_XTALI: C624.1 QZ500.1 R610.1 U1.D9(RTC_XTALI)
RTC_XTALO: C639.1 QZ500.2 R610.2 U1.C9(RTC_XTALO)
SATA_DEVSLP: R676.2 ; off-sheet SATA_DEVSLP
SATA_REXT: R619.1 U1.C14(SATA_REXT)
SATA_RXN: U1.A14(SATA_RXM) ; off-sheet SATA_RXN
SATA_RXP: U1.B14(SATA_RXP) ; off-sheet SATA_RXP
SATA_TXN: U1.B12(SATA_TXM) ; off-sheet SATA_TXN
SATA_TXP: U1.A12(SATA_TXP) ; off-sheet SATA_TXP
SATA_VP: C678.1 C681.1 R96.2 U1.G13(SATA_VP)
SATA_VPH: C668.1 C673.1 R87.2 U1.G12(SATA_VPH)
SD2_CD_B: U1.F16(NANDF_D2) ; off-sheet SD2_CD_B
SD2_CLK: U1.C21(SD2_CLK) ; off-sheet SD2_CLK
SD2_CMD: U1.F19(SD2_CMD) ; off-sheet SD2_CMD
SD2_DATA0: U1.A22(SD2_DAT0) ; off-sheet SD2_DATA0
SD2_DATA1: U1.E20(SD2_DAT1) ; off-sheet SD2_DATA1
SD2_DATA2: U1.A23(SD2_DAT2) ; off-sheet SD2_DATA2
SD2_DATA3: U1.B22(SD2_DAT3) ; off-sheet SD2_DATA3
SD2_DATA4: U1.A19(NANDF_D4) ; off-sheet SD2_DATA4
SD2_DATA5: U1.B18(NANDF_D5) ; off-sheet SD2_DATA5
SD2_DATA6: U1.E17(NANDF_D6) ; off-sheet SD2_DATA6
SD2_DATA7: U1.C18(NANDF_D7) ; off-sheet SD2_DATA7
SD2_WP: U1.D17(NANDF_D3) ; off-sheet SD2_WP
SD3_CD_B: U1.A18(NANDF_D0) ; off-sheet SD3_CD_B
SD3_CLK: U1.D14(SD3_CLK) ; off-sheet SD3_CLK
SD3_CMD: U1.B13(SD3_CMD) ; off-sheet SD3_CMD
SD3_DATA0: U1.E14(SD3_DAT0) ; off-sheet SD3_DATA0
SD3_DATA1: U1.F14(SD3_DAT1) ; off-sheet SD3_DATA1
SD3_DATA2: U1.A15(SD3_DAT2) ; off-sheet SD3_DATA2
SD3_DATA3: U1.B15(SD3_DAT3) ; off-sheet SD3_DATA3
SD3_DATA4: U1.D13(SD3_DAT4) ; off-sheet SD3_DATA4
SD3_DATA5: U1.C13(SD3_DAT5) ; off-sheet SD3_DATA5
SD3_DATA6: U1.E13(SD3_DAT6) ; off-sheet SD3_DATA6
SD3_DATA7: U1.F13(SD3_DAT7) ; off-sheet SD3_DATA7
SD3_RST: R553.2 U1.D15(SD3_RST)
SD3_WP: U1.C17(NANDF_D1) ; off-sheet SD3_WP
SD4_CLK: U1.E16(SD4_CLK) ; off-sheet SD4_CLK
SD4_CMD: U1.B17(SD4_CMD) ; off-sheet SD4_CMD
SD4_DATA0: U1.D18(SD4_DAT0) ; off-sheet SD4_DATA0
SD4_DATA1: U1.B19(SD4_DAT1) ; off-sheet SD4_DATA1
SD4_DATA2: U1.F17(SD4_DAT2) ; off-sheet SD4_DATA2
SD4_DATA3: U1.A20(SD4_DAT3) ; off-sheet SD4_DATA3
SD4_DATA4: U1.E18(SD4_DAT4) ; off-sheet SD4_DATA4
SD4_DATA5: U1.C19(SD4_DAT5) ; off-sheet SD4_DATA5
SD4_DATA6: U1.B20(SD4_DAT6) ; off-sheet SD4_DATA6
SD4_DATA7: U1.D19(SD4_DAT7) ; off-sheet SD4_DATA7
SENSOR_PWR_EN: R136.1 ; off-sheet SENSOR_PWR_EN
SPDIF_CLK: R114.1 U1.R3(GPIO_7) ; off-sheet SPDIF_CLK
SPDIF_OUT: R596.1 U1.R1(GPIO_17) ; off-sheet SPDIF_OUT
TAMPER: U1.E11(TAMPER) ; off-sheet TAMPER
TEST_MODE: U1.E12(TEST_MODE) ; off-sheet TEST_MODE
TP31_16767721: TP31.1(Pin1) U1.W1(LVDS0_TX3_P)
TP32_16767721: TP32.1(Pin1) U1.W2(LVDS0_TX3_N)
TP509: TP509.1(Pin1) U1.AA3(LVDS1_TX3_N)
TP510: TP510.1(Pin1) U1.AA4(LVDS1_TX3_P)
TS_INT: R128.1 ; off-sheet TS_INT
UART1_RX: U1.M3(CSI0_DAT11) ; off-sheet UART1_RX
UART1_TX: U1.M1(CSI0_DAT10) ; off-sheet UART1_TX
UART3_RXD: R126.1 ; off-sheet UART3_RXD
UART3_TXD: R127.1 ; off-sheet UART3_TXD
UOK_B: U1.W21(ENET_RXD0) ; off-sheet UOK_B
USB_H1_OC: R134.1 ; off-sheet USB_H1_OC
USB_H1_PWR_EN: U1.W20(ENET_TXD1) ; off-sheet USB_H1_PWR_EN
USB_HOST_DN: U1.F10(USB_H1_DN) ; off-sheet USB_HOST_DN
USB_HOST_DP: U1.E10(USB_H1_DP) ; off-sheet USB_HOST_DP
USB_OTG_DN: U1.B6(USB_OTG_DN) ; off-sheet USB_OTG_DN
USB_OTG_DP: U1.A6(USB_OTG_DP) ; off-sheet USB_OTG_DP
USB_OTG_ID: U1.W23(ENET_RX_ER) ; off-sheet USB_OTG_ID
USB_OTG_OC: R125.1 ; off-sheet USB_OTG_OC
USB_OTG_PWR_EN: R137.1 ; off-sheet USB_OTG_PWR_EN
USR_DEF_RED_LED: R588.2 ; off-sheet USR_DEF_RED_LED
VDDUSB: C627.1 C633.1 U1.F9(VDDUSB_CAP)
WDOG_B: R300.2 ; off-sheet WDOG_B

Not connected (* = marked no-connect by the designer): U1 A9(MLB_SN) A10(MLB_DP) A11(MLB_CN) B8(~{USB_OTG_CHD}) B9(MLB_SP) B10(MLB_DN) B11(MLB_CP) C5(CLK2_N) D5(CLK2_P) E1(CSI_D2M) E2(CSI_D2P) F1(CSI_D3P) F2(CSI_D3M) R2(GPIO_16); U514 5(NC)

## Notes on the sheet
- HSYNC
- CNTRST
- VSYNC
- DRDY
- Place C726
  close to i.MX6.
- CSI_MCLK
- Depopulate  R121, R123, R133, R138, R139,
  R167, R168, and R627 when using E-BOOK
  Card in 16-bit Data Mode.
- Refer to build options table for assembly
  options on muxed signal resistors.
- (near R219) NOTE:
  To configure SD board to run in Secure HDMI mode:
  1) Depopulate R153 and R154 (schematic page 22)
  This removes HDMI comms channel from I2C2.
  2) Populated R218 and R219.
  This connects HDMI comms to DDC capable pins.
  3) Depopulate R168.
  This deconflicts HDMI comms from the compass interrupt.
  4) Populate R217 to connect COMP_INT to processor.
  This connects COMP_INT to a different GPIO pin.
  5) R167 may be left populated or depopulated as desired.
- NOTE:
  R302 is provided for testing with an alternate power supply
  for USB_H1_VBUS. It has not yet been tested. See the
  Freescale HW User Guide for the Smart Device board
  for details (to be published 4Q12).
- Note:
  1) R216 is required to correct
  a known 24MHz slow starting
  issue present on some iMX 6
  part. Please refer to the i.MX 6
  Processor Errata, issue
  # ERR003745 for more details.
  2) Per bulletin EB830, the i.MX6
  processor may drive the 24 MHz
  crystal up to 250 uW. Freescale
  recommends following the guidelines
  contained in the bulletin.
  The HW Developer Guide contains
  additional information.
- Layout: High speed data lines : 50 ohms
- NOTE:
  In early designs of the Smart Device board, these bulk capacitors were used.
  After testing of the board, it was found that these capacitors could be
  removed with no effect. This reduces the capacitve loading on the internal processor
  LDOs. The coponents/footprints have been left in place in the event that future
  applications and/or software changes show that these capacitors are needed.
- NVCC_LVDS2P5 also powers on-chip DDR I/O predrivers,
  and must be powered whether LVDS is used or not.
- (in symbol PCIMX6Q6VV1A, part A) i.MX6Q - EIM
- (in symbol PCIMX6Q6VV1A, part B) i.MX6Q
- (in symbol PCIMX6Q6VV1A, part C) i.MX6Q - CONTROL
- (in symbol PCIMX6Q6VV1A, part D) i.MX6Q - DISP; CSI
- (in symbol PCIMX6Q6VV1A, part F) i.MX6Q - SATA
- (in symbol PCIMX6Q6VV1A, part G) i.MX6Q - USB
- (in symbol PCIMX6Q6VV1A, part H) i.MX6Q - LVDS
- (in symbol PCIMX6Q6VV1A, part I) i.MX6Q - HDMI
- (in symbol PCIMX6Q6VV1A, part K) i.MX6Q - RGMII
- (in symbol PCIMX6Q6VV1A, part L) i.MX6Q - PCIe
- (in symbol TitleBlock_FS) ICAP Classification:; FCP:; FIUO:; PUBI:; Drawing Title:; Page Title:; Size; Document Number; Rev; Date:; Sheet; of

## Library data of the parts
* = TitleBlock_FS: OrgName: Freescale Semiconductor; OrgAddr1: 6501 William Cannon Drive West; OrgAddr2: Austin, TX 78735-8598; FCP: ___; Page Create Date: March  8, 1995
C39 = CAP_NP: CAP CER 4.7UF 10V 10% X5R 0603; CLASS: DISCRETE; SIGNAL_MODEL: DEFAULT_CAPACITOR_4.7e+06pF_2_1; WVDC: 6.3V; AGILE_PN: 150-77975; MFG_NAME01: TAIYO YUDEN; MFG_PN01: LMK107BJ475KA-T; CAD_APPROVED: Yes; FPLIST: CC0603_OV,CC0603,0603_CC; Tolerance: 10%; ROHS: Yes; HEIGHT: 0.9MM; VOLTAGE: 10V
C51 = CAP_NP: CAP CER 18PF 50V 1% C0G 0402; CLASS: DISCRETE; SIGNAL_MODEL: DEFAULT_CAPACITOR_18pF_2_1; ROOM: ATLAS-AP; PRIORITY_PN: 021-00248; CAD_APPROVED: Yes; MFG_PN01: 0402G180F500SNT; MFG_NAME01: CAPAX TECHNOLOGIES INC.; AGILE_PN: 150-76630; FPLIST: CC0402_25,CC0402_HD,0402_CC; VOLTAGE: 50V; HEIGHT: 0.59MM; ROHS: Yes; Tolerance: 1%
C55 = CAP_NP: CAP CER 18PF 50V 1% C0G 0402; CLASS: DISCRETE; SIGNAL_MODEL: DEFAULT_CAPACITOR_18pF_2_1; FPLIST: CC0402_25,CC0402_HD,0402_CC; AGILE_PN: 150-76630; MFG_NAME01: CAPAX TECHNOLOGIES INC.; MFG_PN01: 0402G180F500SNT; CAD_APPROVED: Yes; PRIORITY_PN: 021-00248; ROOM: ATLAS-AP; VOLTAGE: 50V; Tolerance: 1%; ROHS: Yes; HEIGHT: 0.59MM
C606-C608 C673 C681 = CAP_NP: CAP CER 4.7UF 6.3V 10% X5R 0603; CLASS: DISCRETE; ROOM: IMX6X_SOC; AGILE_PN: 150-75487; MFG_NAME01: VENKEL COMPANY; MFG_PN01: C0603X5R6R3-475KNP; CAD_APPROVED: Yes; FPLIST: CC0603_OV,CC0603,0603_CC; PRIORITY_PN: 021-00280; SIGNAL_MODEL: DEFAULT_CAPACITOR_4.7e+06pF_2_1; VOLTAGE: 6.3V; Tolerance: 10%; ROHS: Yes; HEIGHT: 1.016MM; WVDC: 6.3V
C609 = CAP_NP: CAP CER 4.7UF 6.3V 10% X5R 0603; CLASS: DISCRETE; SIGNAL_MODEL: DEFAULT_CAPACITOR_4.7e+06pF_2_1; ROOM: IMX6X_SOC; AGILE_PN: 150-75487; MFG_NAME01: VENKEL COMPANY; MFG_PN01: C0603X5R6R3-475KNP; CAD_APPROVED: Yes; FPLIST: CC0603_OV,CC0603,0603_CC; PRIORITY_PN: 021-00280; WVDC: 6.3V; Tolerance: 10%; ROHS: Yes; HEIGHT: 1.016MM; VOLTAGE: 6.3V
C610 = CAP_NP: CAP CER 4.7UF 6.3V 10% X5R 0603; CLASS: DISCRETE; SIGNAL_MODEL: DEFAULT_CAPACITOR_4.7e+06pF_2_1; PRIORITY_PN: 021-00280; FPLIST: CC0603_OV,CC0603,0603_CC; CAD_APPROVED: Yes; MFG_PN01: C0603X5R6R3-475KNP; MFG_NAME01: VENKEL COMPANY; AGILE_PN: 150-75487; ROOM: IMX6X_SOC; WVDC: 6.3V; HEIGHT: 1.016MM; ROHS: Yes; Tolerance: 10%; VOLTAGE: 6.3V
C622 C626 C633 C640 C641 = CAP_NP: CAP CER 0.22UF 6.3V 20% X5R 0201; CLASS: DISCRETE; SIGNAL_MODEL: DEFAULT_CAPACITOR_220000pF_2_1; ROOM: CPU; AGILE_PN: 150-77852; MFG_NAME01: TAIYO YUDEN; MFG_PN01: JMK063BJ224MP-F; CAD_APPROVED: Yes; FPLIST: CC0201,CC0201_HD,0201_CC,cc_0201_cir; PRIORITY_PN: 021-00278; Tolerance: 20%; ROHS: Yes; HEIGHT: 0.33 MM; VOLTAGE: 6.3V
C624 = CAP_NP: CAP CER 18PF 50V 1% C0G 0402; CLASS: DISCRETE; ROOM: ATLAS-AP; PRIORITY_PN: 021-00248; CAD_APPROVED: Yes; MFG_PN01: 0402G180F500SNT; MFG_NAME01: CAPAX TECHNOLOGIES INC.; AGILE_PN: 150-76630; FPLIST: CC0402_25,CC0402_HD,0402_CC; SIGNAL_MODEL: DEFAULT_CAPACITOR_18pF_2_1; VOLTAGE: 50V; HEIGHT: 0.59MM; ROHS: Yes; Tolerance: 1%
C625 C668 = CAP_NP: CAP CER 0.22UF 6.3V 20% X5R 0201; CLASS: DISCRETE; PRIORITY_PN: 021-00278; FPLIST: CC0201,CC0201_HD,0201_CC,cc_0201_cir; CAD_APPROVED: Yes; MFG_PN01: JMK063BJ224MP-F; MFG_NAME01: TAIYO YUDEN; AGILE_PN: 150-77852; ROOM: CPU; SIGNAL_MODEL: DEFAULT_CAPACITOR_220000pF_2_1; VOLTAGE: 6.3V; HEIGHT: 0.33 MM; ROHS: Yes; Tolerance: 20%
C627 = CAP_NP: CAP CER 10UF 6.3V 10% X5R 0603; CLASS: DISCRETE; SIGNAL_MODEL: DEFAULT_CAPACITOR_1e+07pF_2_1; AGILE_PN: 150-77832; MFG_NAME01: TDK; MFG_PN01: C1608X5R0J106KT; CAD_APPROVED: Yes; FPLIST: CC0603_OV,CC0603,0603_CC; PRIORITY_PN: 021-00276; Tolerance: 10%; ROHS: Yes; HEIGHT: 1.0MM; VOLTAGE: 6.3V
C632 C638 C678 = CAP_NP: CAP CER 0.22UF 6.3V 20% X5R 0201; CLASS: DISCRETE; ROOM: CPU; AGILE_PN: 150-77852; MFG_NAME01: TAIYO YUDEN; MFG_PN01: JMK063BJ224MP-F; CAD_APPROVED: Yes; FPLIST: CC0201,CC0201_HD,0201_CC,cc_0201_cir; PRIORITY_PN: 021-00278; SIGNAL_MODEL: DEFAULT_CAPACITOR_220000pF_2_1; VOLTAGE: 6.3V; Tolerance: 20%; ROHS: Yes; HEIGHT: 0.33 MM
C635 = CAP_NP: CAP CER 0.22UF 6.3V 20% X5R 0201; CLASS: DISCRETE; SIGNAL_MODEL: DEFAULT_CAPACITOR_220000pF_2_1; PRIORITY_PN: 021-00278; FPLIST: CC0201,CC0201_HD,0201_CC,cc_0201_cir; CAD_APPROVED: Yes; MFG_PN01: JMK063BJ224MP-F; MFG_NAME01: TAIYO YUDEN; AGILE_PN: 150-77852; ROOM: CPU; HEIGHT: 0.33 MM; ROHS: Yes; Tolerance: 20%; VOLTAGE: 6.3V
C639 = CAP_NP: CAP CER 18PF 50V 1% C0G 0402; CLASS: DISCRETE; FPLIST: CC0402_25,CC0402_HD,0402_CC; PRIORITY_PN: 021-00248; CAD_APPROVED: Yes; MFG_PN01: 0402G180F500SNT; MFG_NAME01: CAPAX TECHNOLOGIES INC.; AGILE_PN: 150-76630; ROOM: ATLAS-AP; SIGNAL_MODEL: DEFAULT_CAPACITOR_18pF_2_1; VOLTAGE: 50V; HEIGHT: 0.59MM; ROHS: Yes; Tolerance: 1%
C642 = CAP_NP: CAP CER 0.22UF 10V 20% X5R 0201; CLASS: DISCRETE; SIGNAL_MODEL: DEFAULT_CAPACITOR_220000pF_2_1; ROOM: CPU; AGILE_PN: 150-78815; MFG_NAME01: Taiyo Yuden; MFG_PN01: LMK063BJ224MP-F; CAD_APPROVED: Yes; FPLIST: CC0201,CC0201_HD,0201_CC,CC_0201_CIR,0201_CC_012SM; PRIORITY_PN: 021-00278; Tolerance: 20%; ROHS: Yes; HEIGHT: 0.33MM; VOLTAGE: 10V
C651 = CAP_NP: CAP CER 0.22UF 10V 20% X5R 0201; CLASS: DISCRETE; SIGNAL_MODEL: DEFAULT_CAPACITOR_220000pF_2_1; PRIORITY_PN: 021-00278; FPLIST: CC0201,CC0201_HD,0201_CC,CC_0201_CIR,0201_CC_012SM; CAD_APPROVED: Yes; MFG_PN01: LMK063BJ224MP-F; MFG_NAME01: Taiyo Yuden; AGILE_PN: 150-78815; ROOM: CPU; VOLTAGE: 10V; HEIGHT: 0.33MM; ROHS: Yes; Tolerance: 20%
C726 = CAP_NP: CAP CER 1.0UF 10V 10% X5R 0402; CLASS: DISCRETE; AGILE_PN: 150-75772; MFG_NAME01: YAGEO AMERICA; MFG_PN01: CC0402KRX5R6BB105; CAD_APPROVED: Yes; FPLIST: CC0402_25,CC0402_HD,0402_CC; SIGNAL_MODEL: DEFAULT_CAPACITOR_1e+06pF_2_1; ROHS: Yes; HEIGHT: 0.6MM
L13 = BEAD_0: IND FER BEAD 120OHM@100MHZ 2A 25% 0603; PART_TYPE: FERRITE; CLASS: DISCRETE; PRIORITY_PN: 024-00067; MFG_NAME01: MURATA; CAD_APPROVED: Yes; FPLIST: IND_0603,0603_CC; AGILE_PN: 180-30008; MFG_PN01: BLM18PG121SH1; Tolerance: 25%; HEIGHT: 0.95MM; ROHS: Yes
QZ500 = XTAL: XTAL 32.768KHZ 12.5PF 20PPM 3.2X1.5MM SMT; CLASS: IC; CAD_APPROVED: Yes; MFG_PN01: ABS07-32.768KHZ-T; MFG_NAME01: Abracon Corporation; AGILE_PN: 230-77653; HEIGHT: 0.9MM; ROHS: Yes
R36 R49 R122 R123 R125 R126 R132 R134 R136 R137 R168 R171 R217-R219 R588 R627 = RES: RES MF ZERO OHM 1/10W -- 0402; CLASS: DISCRETE; FPLIST: RC0402_25,RC0402_HD,RC0402_X2,0402_CC; CAD_APPROVED: Yes; MFG_PN01: ERJ-2GE0R00X; MFG_NAME01: Panasonic; AGILE_PN: 470-79965; SIGNAL_MODEL: DEFAULT_RESISTOR_0.001OHM_2_1; ROHS: Yes
R37 = RES: RES MF 1.6K  1/16W 1% 0402; CLASS: DISCRETE; ROOM: IMX6X_SOC; PRIORITY_PN: 006-01002; FPLIST: RC0402_25,RC0402_HD,0402_CC; CAD_APPROVED: Yes; MFG_PN01: RK73H1ETTP1601F; MFG_NAME01: KOA SPEER; AGILE_PN: 470-30856; SIGNAL_MODEL: DEFAULT_RESISTOR_1600OHM_2_1; ROHS: Yes
R38 = RES: RES MF 6.04K  1/16W 1% 0402; CLASS: DISCRETE; PRIORITY_PN: 006-01007; FPLIST: RC0402_25,RC0402_HD,0402_CC; CAD_APPROVED: Yes; MFG_PN01: RK73H1ETTP6041F; MFG_NAME01: KOA SPEER; AGILE_PN: 470-30923; SIGNAL_MODEL: DEFAULT_RESISTOR_6040OHM_2_1; ROHS: Yes
R40-R42 R44 R59 = RES: RES MF 33 OHM 1/16W 5% 0402; CLASS: DISCRETE; FPLIST: RC0402_25,RC0402_HD,0402_CC; CAD_APPROVED: Yes; MFG_PN01: RC73L2Z330JTF; MFG_NAME01: SMEC; AGILE_PN: 470-75634; SIGNAL_MODEL: DEFAULT_RESISTOR_33OHM_2_1; ROHS: Yes; Tolerance: 5%
R46 R87 R300 R600 = RES: RES MF ZERO OHM 1/10W -- 0402; CLASS: DISCRETE; SIGNAL_MODEL: DEFAULT_RESISTOR_0.001OHM_2_1; AGILE_PN: 470-79965; MFG_NAME01: Panasonic; MFG_PN01: ERJ-2GE0R00X; CAD_APPROVED: Yes; FPLIST: RC0402_25,RC0402_HD,RC0402_X2,0402_CC; ROHS: Yes
R48 R96 = RES: RES MF ZERO OHM 1/10W -- 0402; CLASS: DISCRETE; SIGNAL_MODEL: DEFAULT_RESISTOR_0.001OHM_2_1; FPLIST: RC0402_25,RC0402_HD,RC0402_X2,0402_CC; CAD_APPROVED: Yes; MFG_PN01: ERJ-2GE0R00X; MFG_NAME01: Panasonic; AGILE_PN: 470-79965; ROHS: Yes
R50 R66 R69 R114 R120 R121 R124 R127-R129 R131 R133 R135 R138 R139 R167 R594 R596 R597 R656 R661 R676 = RES: RES MF ZERO OHM 1/10W -- 0402; CLASS: DISCRETE; AGILE_PN: 470-79965; MFG_NAME01: Panasonic; MFG_PN01: ERJ-2GE0R00X; CAD_APPROVED: Yes; FPLIST: RC0402_25,RC0402_HD,RC0402_X2,0402_CC; SIGNAL_MODEL: DEFAULT_RESISTOR_0.001OHM_2_1; ROHS: Yes
R51 R52 R54 R56 R57 R60 R62 R65 R67 R70 R72-R74 R76 R79-R82 R84 R86 R88 R90 R91 R113 = RES: RES MF 33 OHM 1/16W 5% 0402; CLASS: DISCRETE; AGILE_PN: 470-75634; MFG_NAME01: SMEC; MFG_PN01: RC73L2Z330JTF; CAD_APPROVED: Yes; FPLIST: RC0402_25,RC0402_HD,0402_CC; SIGNAL_MODEL: DEFAULT_RESISTOR_33OHM_2_1; Tolerance: 5%; ROHS: Yes
R75 = RES: RES MF 10M 1/16W 1% 0402; CLASS: DISCRETE; SIGNAL_MODEL: DEFAULT_RESISTOR_0.01OHM_2_1; ROOM: MARLEY; AGILE_PN: 470-76481; MFG_NAME01: THYE MING TECH CO LTD; MFG_PN01: CR02FL6--10M; CAD_APPROVED: Yes; PRIORITY_PN: 006-00664; FPLIST: RC0402_25,RC0402_HD,0402_CC; Tolerance: 1%; ROHS: Yes
R216 = RES: RES MF 2.2M  1/16W 1% 0402; CLASS: DISCRETE; AGILE_PN: 470-31210; MFG_NAME01: KOA SPEER; MFG_PN01: RK73H1ETTP2204F; CAD_APPROVED: Yes; FPLIST: RC0402_25,RC0402_HD,0402_CC; Tolerance: 1%; ROHS: Yes
R301 = RES: RES MF ZERO OHM 1/10W -- 0402; CLASS: DISCRETE; SIGNAL_MODEL: DEFAULT_RESISTOR_0.001OHM_2_1; AGILE_PN: 470-79965; MFG_NAME01: Panasonic; MFG_PN01: ERJ-2GE0R00X; CAD_APPROVED: Yes; FPLIST: RC0402_25,RC0402_HD,RC0402_X2,0402_CC; PRIORITY_PN: 006-00559; ROOM: HDMI; ROHS: Yes
R302 R652 R653 = RES: RES MF ZERO OHM 1/10W -- 0402; CLASS: DISCRETE; ROOM: HDMI; PRIORITY_PN: 006-00559; FPLIST: RC0402_25,RC0402_HD,RC0402_X2,0402_CC; CAD_APPROVED: Yes; MFG_PN01: ERJ-2GE0R00X; MFG_NAME01: Panasonic; AGILE_PN: 470-79965; SIGNAL_MODEL: DEFAULT_RESISTOR_0.001OHM_2_1; ROHS: Yes
R553 = RES: RES MF ZERO OHM 1/10W -- 0402; CLASS: DISCRETE; PRIORITY_PN: 006-00559; FPLIST: RC0402_25,RC0402_HD,RC0402_X2,0402_CC; CAD_APPROVED: Yes; MFG_PN01: ERJ-2GE0R00X; MFG_NAME01: Panasonic; AGILE_PN: 470-79965; ROOM: ATLAS-AP; SIGNAL_MODEL: DEFAULT_RESISTOR_0.001OHM_2_1; ROHS: Yes
R604 = RES: RES MF 200 OHM 1/16W 1% 0402; CLASS: DISCRETE; SIGNAL_MODEL: DEFAULT_RESISTOR_200OHM_2_1; PRIORITY_PN: 006-00658; FPLIST: RC0402_25,RC0402_HD,0402_CC; CAD_APPROVED: Yes; MFG_PN01: CR02FL6--200R; MFG_NAME01: THYE MING TECH CO LTD; AGILE_PN: 470-76255; ROOM: IMX6X_SOC; ROHS: Yes
R605 = RES: RES MF 6.04K  1/16W 1% 0402; CLASS: DISCRETE; AGILE_PN: 470-30923; MFG_NAME01: KOA SPEER; MFG_PN01: RK73H1ETTP6041F; CAD_APPROVED: Yes; FPLIST: RC0402_25,RC0402_HD,0402_CC; PRIORITY_PN: 006-01007; SIGNAL_MODEL: DEFAULT_RESISTOR_6040OHM_2_1; ROHS: Yes
R610 = RES: RES MF 10M 1/16W 1% 0402; CLASS: DISCRETE; ROOM: MARLEY; AGILE_PN: 470-76481; MFG_NAME01: THYE MING TECH CO LTD; MFG_PN01: CR02FL6--10M; CAD_APPROVED: Yes; PRIORITY_PN: 006-00664; FPLIST: RC0402_25,RC0402_HD,0402_CC; SIGNAL_MODEL: DEFAULT_RESISTOR_0.01OHM_2_1; Tolerance: 1%; ROHS: Yes
R619 = RES: RES MF 191.0 OHM  1/10W 1% 0603; CLASS: DISCRETE; FPLIST: RC0603_OV,RC0603,0603_CC; CAD_APPROVED: Yes; MFG_PN01: RK73H1JTTD1910F; MFG_NAME01: KOA SPEER; AGILE_PN: 470-77920; SIGNAL_MODEL: DEFAULT_RESISTOR_191OHM_2_1; ROHS: Yes
R623 = RES: RES MF 68K  1/16W 1% 0402; CLASS: DISCRETE; FPLIST: RC0402_25,RC0402_HD,0402_CC; CAD_APPROVED: Yes; MFG_PN01: RK73H1ETTP6802F; MFG_NAME01: KOA SPEER; AGILE_PN: 470-31042; SIGNAL_MODEL: DEFAULT_RESISTOR_68000OHM_2_1; ROHS: Yes; Tolerance: 1%
R624 = RES: RES MF 68K  1/16W 1% 0402; CLASS: DISCRETE; AGILE_PN: 470-31042; MFG_NAME01: KOA SPEER; MFG_PN01: RK73H1ETTP6802F; CAD_APPROVED: Yes; FPLIST: RC0402_25,RC0402_HD,0402_CC; SIGNAL_MODEL: DEFAULT_RESISTOR_68000OHM_2_1; Tolerance: 1%; ROHS: Yes
TP31 TP32 = TESTLOOP: TEST POINT PAD 0.5MM DIA SMT, NO PART TO ORDER; CLASS: IO; CAD_APPROVED: Yes; ASSY_OPT: DNP; AGILE_PN: 211-77484; HEIGHT: 0.1MM; ROHS: Yes
TP509 TP510 = TESTLOOP: TEST POINT PAD 0.5MM DIA SMT, NO PART TO ORDER; CLASS: IO; AGILE_PN: 211-77484; ASSY_OPT: DNP; CAD_APPROVED: Yes; ROHS: Yes; HEIGHT: 0.1MM
U1 = PCIMX6Q6VV1A: IC MCU MX6QUAD ARM CORTEX-A9 FCPBGA624; AGILE_PN: 344-01218; MFG_NAME01: FREESCALE SEMICONDUCTOR; CAD_APPROVED: Yes; CLASS: IC; MFG_PN01: MCIMX6Q6AVT10AC; ROHS: Yes; HEIGHT: 2.16MM
U514 = NLSV1T34: IC VXLTR 1 BIT DUAL-SUPPLY 0.9-4.5V 613AF; CAD_APPROVED: Yes; MFG_PN01: NLSV1T34AMX1TCG; MFG_NAME01: On Semiconductor; AGILE_PN: 312-79552; CLASS: IC; HEIGHT: 0.4MM; ROHS: Yes
Y1 = XTAL_13Y_A: XTAL 24MHZ -- 3.2X2.5MM SMT; CLASS: IC; AGILE_PN: 230-76455; MFG_NAME01: SIWARD INTERNATIONAL INC; MFG_PN01: XTL571300LLI24.000-10TR; CAD_APPROVED: Yes; ROHS: Yes; HEIGHT: 0.8MM